# EAGLE design controller (EAGLE 6.5.0)
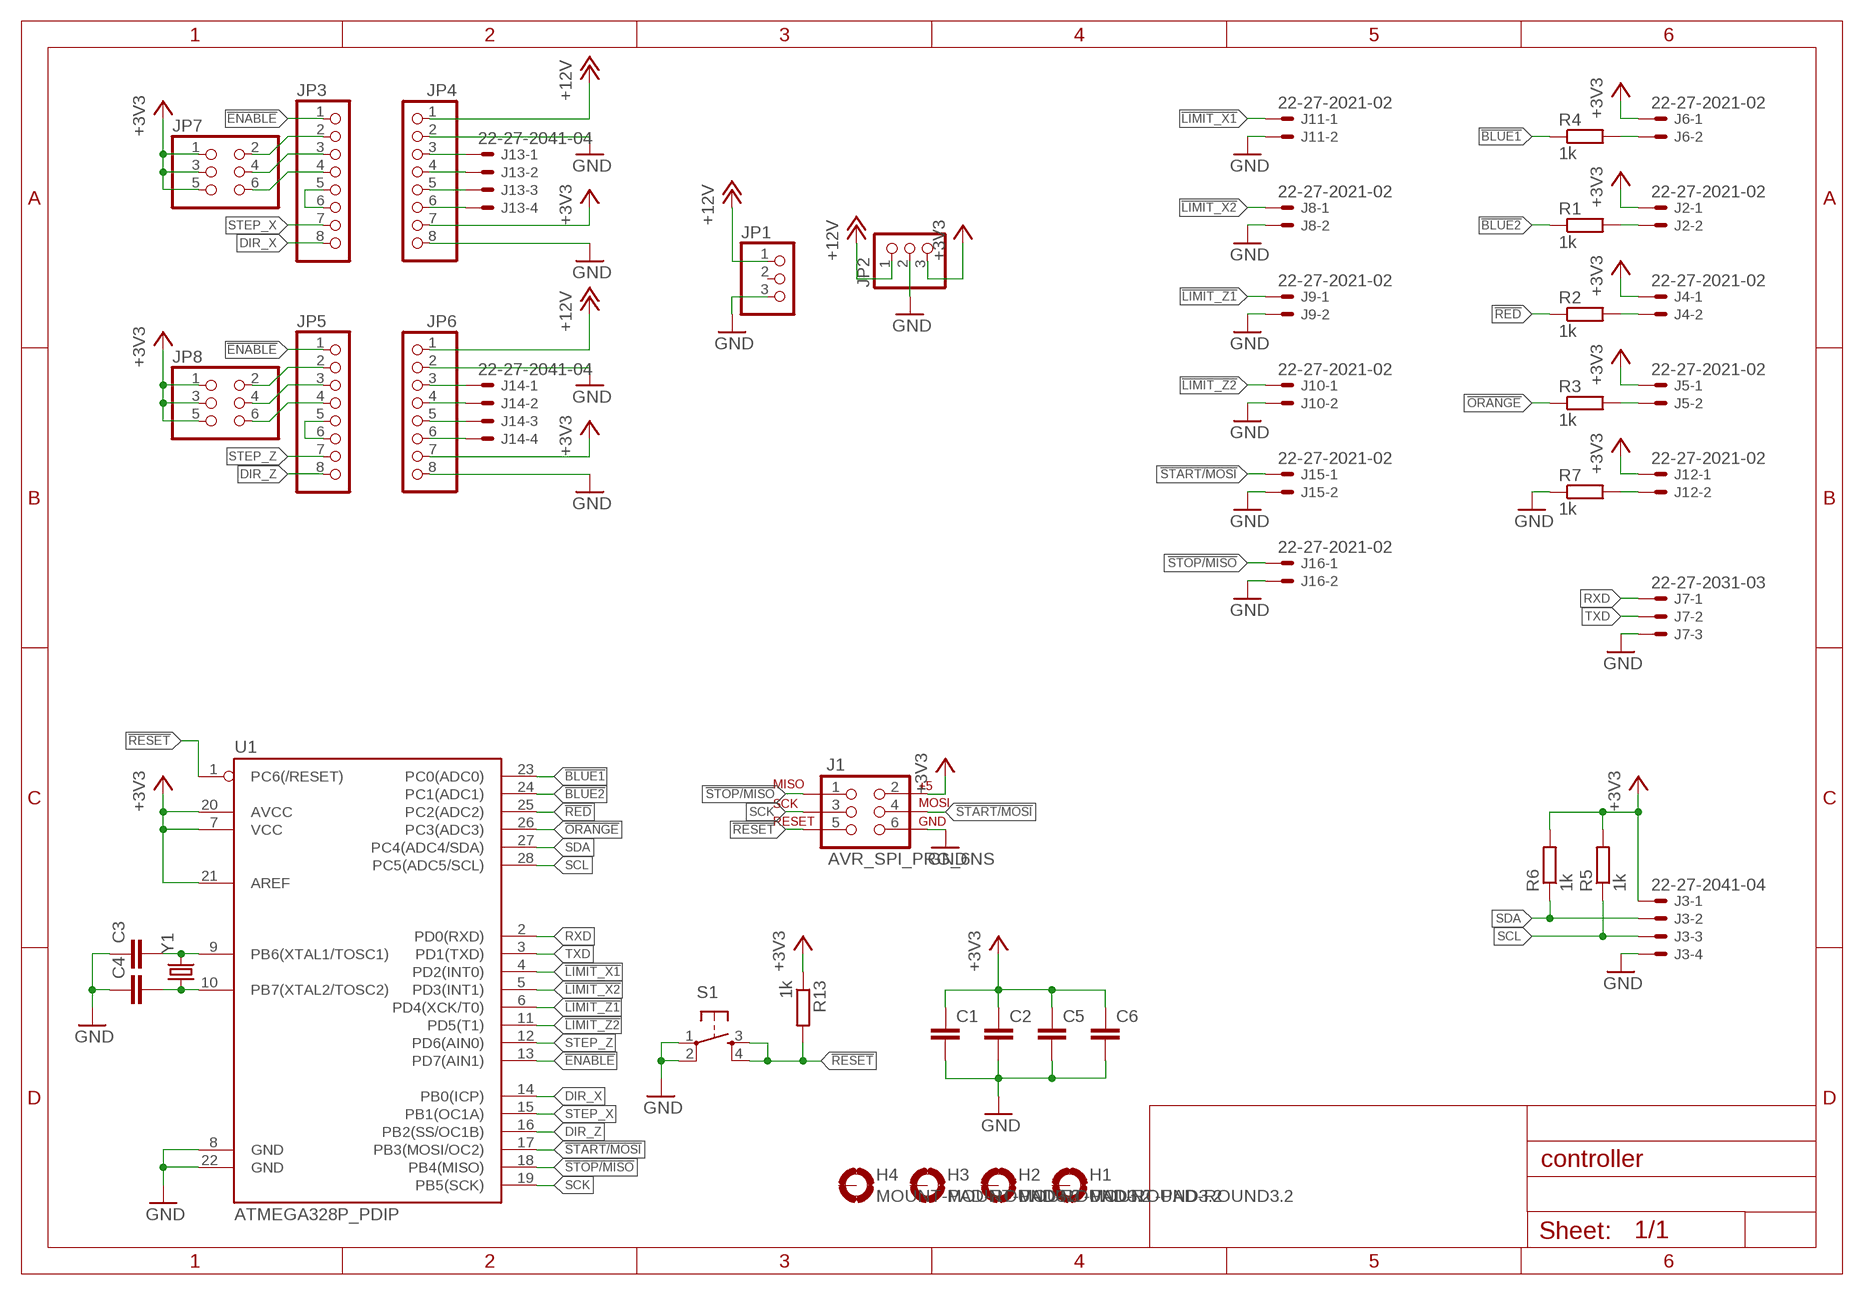
[diagram p0: schematic, sheet 1]

## Parts
C1  C-EUC0603  [C0603]
C2  C-EUC0603  [C0603]
C3  C-EUC0603K  [C0603K]
C4  C-EUC0603K  [C0603K]
C5  C-EUC0603  [C0603]
C6  C-EUC0603  [C0603]
H1  MOUNT-PAD-ROUND3.2  [3,2-PAD]
H2  MOUNT-PAD-ROUND3.2  [3,2-PAD]
H3  MOUNT-PAD-ROUND3.2  [3,2-PAD]
H4  MOUNT-PAD-ROUND3.2  [3,2-PAD]
J1  AVR_SPI_PRG_6NS  [2X3-NS]
J2  22-27-2021-02  [6410-02]
J3  22-27-2041-04  [6410-04]
J4  22-27-2021-02  [6410-02]
J5  22-27-2021-02  [6410-02]
J6  22-27-2021-02  [6410-02]
J7  22-27-2031-03  [6410-03]
J8  22-27-2021-02  [6410-02]
J9  22-27-2021-02  [6410-02]
J10  22-27-2021-02  [6410-02]
J11  22-27-2021-02  [6410-02]
J12  22-27-2021-02  [6410-02]
J13  22-27-2041-04  [6410-04]
J14  22-27-2041-04  [6410-04]
J15  22-27-2021-02  [6410-02]
J16  22-27-2021-02  [6410-02]
JP1  PINHD-1X3  [1X03]
JP2  PINHD-1X3  [1X03]
JP3  PINHD-1X8  [1X08]
JP4  PINHD-1X8  [1X08]
JP5  PINHD-1X8  [1X08]
JP6  PINHD-1X8  [1X08]
JP7  PINHD-2X3  [2X03]
JP8  PINHD-2X3  [2X03]
R1  1k  R-EU_R0603  [R0603]
R2  1k  R-EU_R0603  [R0603]
R3  1k  R-EU_R0603  [R0603]
R4  1k  R-EU_R0603  [R0603]
R5  1k  R-EU_R0603  [R0603]
R6  1k  R-EU_R0603  [R0603]
R7  1k  R-EU_R0603  [R0603]
R13  1k  R-EU_R0603  [R0603]
S1  TAC_SWITCHPTH  [TACTILE-PTH]
U1  ATMEGA328P_PDIP  [DIL28-3]
Y1  CRYSTALHC49UV  [HC49U-V]

## Nets
!BLUE1: R4.1 U1.23(PC0(ADC0))
!BLUE2: R1.1 U1.24(PC1(ADC1))
!ENABLE: JP3.1 JP5.1 U1.13(PD7(AIN1))
!LIMIT_X1: J11.1 U1.4(PD2(INT0))
!LIMIT_X2: J8.1 U1.5(PD3(INT1))
!LIMIT_Z1: J9.1 U1.6(PD4(XCK/T0))
!LIMIT_Z2: J10.1 U1.11(PD5(T1))
!ORANGE: R3.1 U1.26(PC3(ADC3))
!RED: R2.1 U1.25(PC2(ADC2))
!RESET: J1.5 R13.2 S1.3 S1.4 U1.1(PC6(/RESET))
!START/MOSI: J1.4 J15.1 U1.17(PB3(MOSI/OC2))
!STOP/MISO: J1.1 J16.1 U1.18(PB4(MISO))
+3V3: C1.1 C2.1 C5.1 C6.1 J1.2 J2.1 J3.1 J4.1 J5.1 J6.1 J12.1 JP2.3 JP4.7 JP6.7 JP7.1 JP7.3 JP7.5 JP8.1 JP8.3 JP8.5 R5.2 R6.2 R13.1 U1.7(VCC) U1.20(AVCC) U1.21(AREF)
+12V: JP1.1 JP2.1 JP4.1 JP6.1
DIR_X: JP3.8 U1.14(PB0(ICP))
DIR_Z: JP5.8 U1.16(PB2(SS/OC1B))
GND: C1.2 C2.2 C3.1 C4.1 C5.2 C6.2 J1.6 J3.4 J7.3 J8.2 J9.2 J10.2 J11.2 J15.2 J16.2 JP1.3 JP2.2 JP4.2 JP4.8 JP6.2 JP6.8 R7.1 S1.1 S1.2 U1.8(GND) U1.22(GND)
N$1: C3.2 U1.9(PB6(XTAL1/TOSC1)) Y1.2
N$2: C4.2 U1.10(PB7(XTAL2/TOSC2)) Y1.1
N$3: J4.2 R2.2
N$4: J2.2 R1.2
N$5: J5.2 R3.2
N$6: J6.2 R4.2
N$10: JP3.5 JP3.6
N$11: JP3.4 JP7.6
N$12: JP3.3 JP7.4
N$13: JP3.2 JP7.2
N$16: J12.2 R7.2
N$18: JP5.5 JP5.6
N$19: JP5.4 JP8.6
N$20: JP5.3 JP8.4
N$21: JP5.2 JP8.2
N$22: J13.1 JP4.3
N$23: J13.2 JP4.4
N$24: J13.3 JP4.5
N$25: J13.4 JP4.6
N$26: J14.1 JP6.3
N$27: J14.2 JP6.4
N$28: J14.3 JP6.5
N$29: J14.4 JP6.6
RXD: J7.1 U1.2(PD0(RXD))
SCK: J1.3 U1.19(PB5(SCK))
SCL: J3.3 R5.1 U1.28(PC5(ADC5/SCL))
SDA: J3.2 R6.1 U1.27(PC4(ADC4/SDA))
STEP_X: JP3.7 U1.15(PB1(OC1A))
STEP_Z: JP5.7 U1.12(PD6(AIN0))
TXD: J7.2 U1.3(PD1(TXD))
Unconnected: H1.B3,2(MOUNT) H2.B3,2(MOUNT) H3.B3,2(MOUNT) H4.B3,2(MOUNT) JP1.2

## Library data of the parts
C1-C6 = rcl:C-EU: CAPACITOR, European symbol
H1-H4 = holes:MOUNT-PAD-ROUND: MOUNTING PAD, round
J1 = SparkFun-Connectors:AVR_SPI_PRG_6: AVR ISP 6 Pin This is the reduced ISP connector for AVR programming. Common on Arduino. This footprint will take up less PCB space and can be used with a 10-pin to 6-pin adapter such as SKU: BOB-08508
J2 J4-J6 J8-J12 J15 J16 = con-molex:22-?-02: CONNECTOR wire to board 2.54 mm (.1 inch) pitch header; OC_FARNELL: unknown; OC_NEWARK: unknown
J3 J13 J14 = con-molex:22-?-04: CONNECTOR wire to board 2.54 mm (.1 inch) pitch header; OC_FARNELL: unknown; OC_NEWARK: unknown
J7 = con-molex:22-?-03: CONNECTOR wire to board 2.54 mm (.1 inch) pitch header; OC_FARNELL: unknown; OC_NEWARK: unknown
JP1 JP2 = pinhead:PINHD-1X3: PIN HEADER
JP3-JP6 = pinhead:PINHD-1X8: PIN HEADER
JP7 JP8 = pinhead:PINHD-2X3: PIN HEADER
R1-R7 R13 = rcl:R-EU_: RESISTOR, European symbol
S1 = SparkFun-Electromechanical:TAC_SWITCH: Momentary Switch Button commonly used for reset or general input. Spark Fun Electronics SKU : COM-00097 SMT- SWCH-08247
U1 = SparkFun-DigitalIC:ATMEGA328P_PDIP: uC used in the Arduino 32kb flash, 1k EEPROM, 2k SRAM This is the through-hole version of this chip.
Y1 = SparkFun-FreqCtrl:CRYSTAL: Various standard crystals. Proven footprints. Spark Fun Electronics SKU : COM-00534

## Board
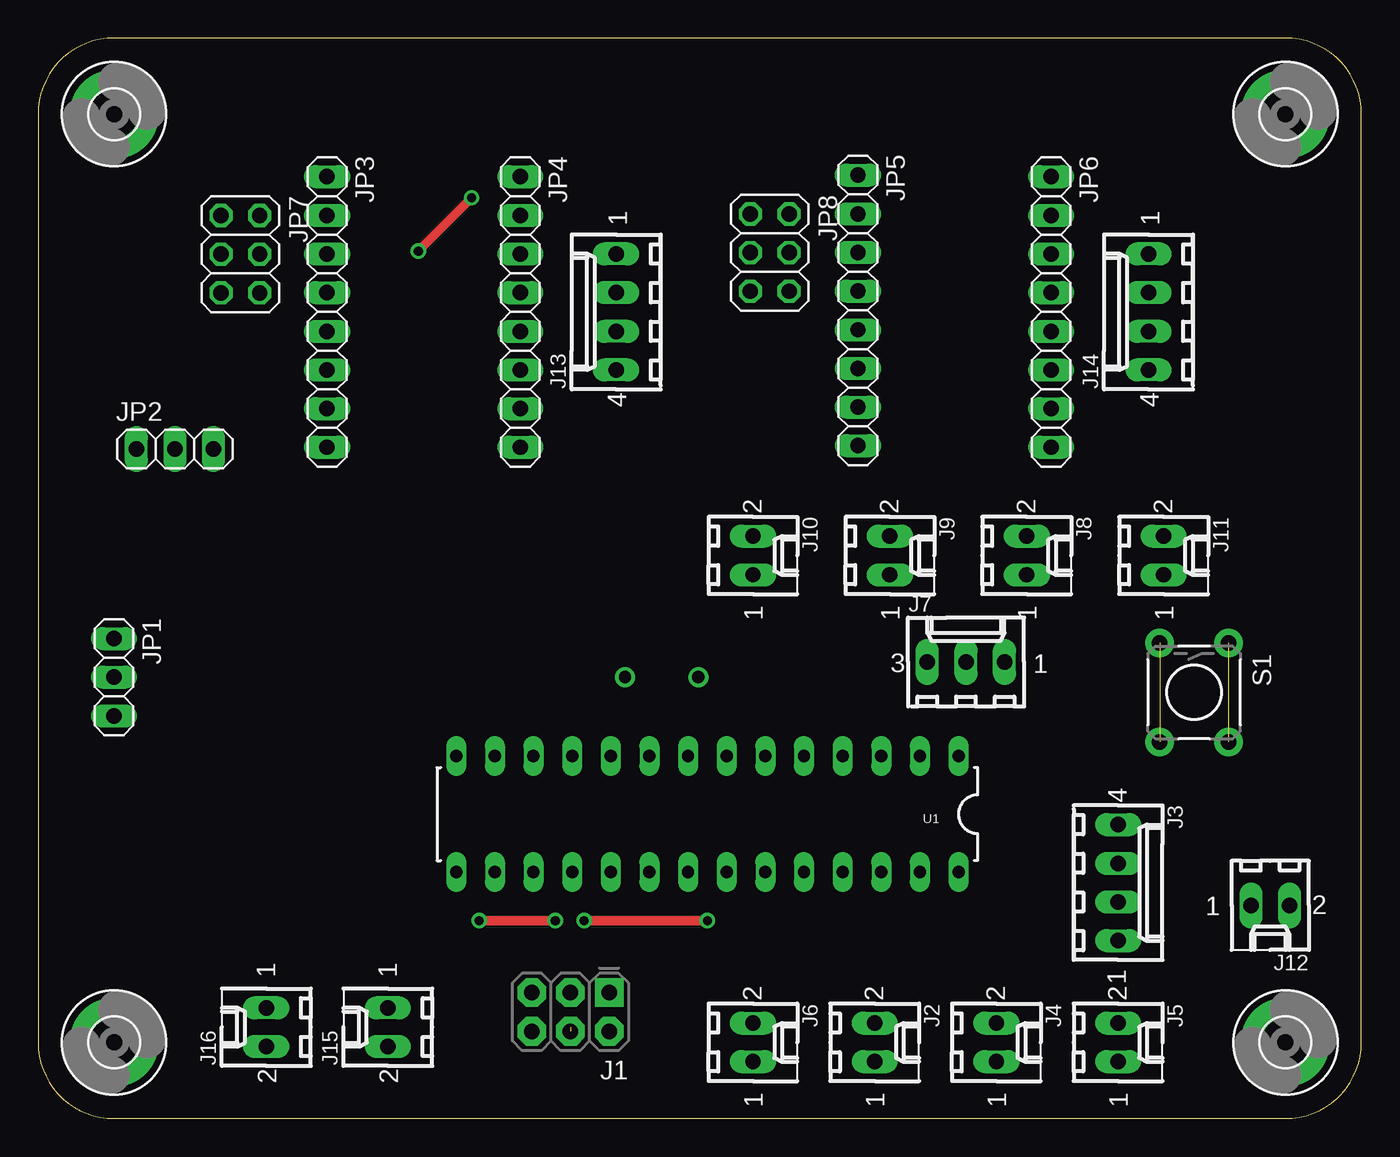
[diagram p1: board, top side]
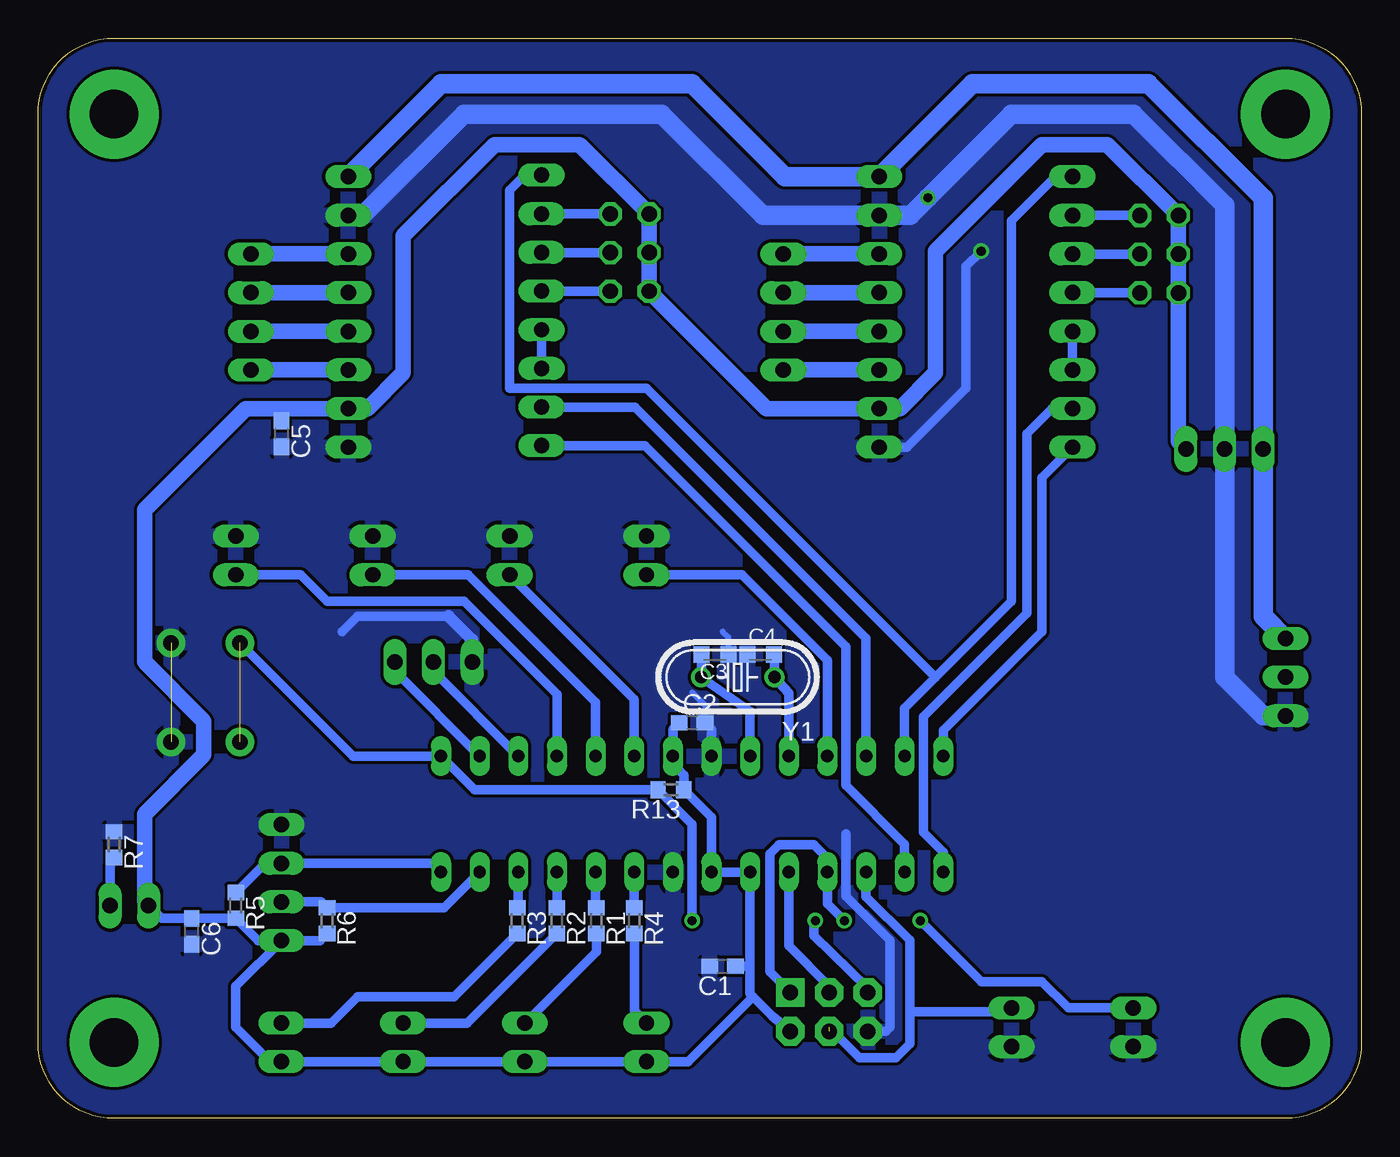
[diagram p2: board, bottom side, seen from below]

Size 87 x 71 mm. Coordinates in mm from the lower left corner, seen from the top.
Outline: 5,0 82,0 arc90 87,5 87,66 arc90 82,71 5,71 arc90 0,66 0,5 arc90 5,0
Copper layers (1*16): Top 0.035mm / dielectric 1.5mm / Bottom 0.035mm
Design rules "default *": minimum track width 10mil, minimum drill 24mil, track to track 8mil, track to pad 8mil, pad to pad 8mil, via to via 8mil, smd to smd 8mil, copper to edge 10mil, drill to drill 8mil, minimum pad ring 10mil, minimum via ring 8mil, stop-mask expansion 4mil, vias tented up to drill 0mil, thermal gap 10mil

### Footprints (pad centres in the part's own frame; a part is rotated, then mirrored left to right if it is on the bottom)
C0603 = smd 1.1 x 1: 1 -0.85,0; 2 0.85,0
C0603K = smd 1.05 x 1.08: 1 -0.875,0; 2 0.875,0
3,2-PAD = drill 3.2 pad 5.842: B3,2 0,0
2X3-NS = drill 1.016 pad 1.88 square: 1 -2.54,-1.27 | drill 1.016 pad 1.88 octagon: 2 -2.54,1.27; 3 0,-1.27; 4 0,1.27; 5 2.54,-1.27; 6 2.54,1.27
6410-02 = drill 1.016 long: 1 1.27,0; 2 -1.27,0
6410-04 = drill 1.016 long: 1 3.81,0; 2 1.27,0; 3 -1.27,0; 4 -3.81,0
6410-03 = drill 1.016 long: 1 2.54,0; 2 0,0; 3 -2.54,0
1X03 = drill 1.016 long: 1 -2.54,0; 2 0,0; 3 2.54,0
1X08 = drill 1.016 long: 1 -8.89,0; 2 -6.35,0; 3 -3.81,0; 4 -1.27,0; 5 1.27,0; 6 3.81,0; 7 6.35,0; 8 8.89,0
2X03 = drill 1.016 octagon: 1 -2.54,-1.27; 2 -2.54,1.27; 3 0,-1.27; 4 0,1.27; 5 2.54,-1.27; 6 2.54,1.27
R0603 = smd 1 x 1.1: 1 -0.85,0; 2 0.85,0
TACTILE-PTH = drill 1.016 pad 1.88: 1 -3.251,2.261; 2 3.251,2.261; 3 -3.251,-2.261; 4 3.251,-2.261
DIL28-3 = drill 0.813 long: 1 -16.51,-3.81; 2 -13.97,-3.81; 3 -11.43,-3.81; 4 -8.89,-3.81; 5 -6.35,-3.81; 6 -3.81,-3.81; 7 -1.27,-3.81; 8 1.27,-3.81; 9 3.81,-3.81; 10 6.35,-3.81; 11 8.89,-3.81; 12 11.43,-3.81; 13 13.97,-3.81; 14 16.51,-3.81; 15 16.51,3.81; 16 13.97,3.81; 17 11.43,3.81; 18 8.89,3.81; 19 6.35,3.81; 20 3.81,3.81; 21 1.27,3.81; 22 -1.27,3.81; 23 -3.81,3.81; 24 -6.35,3.81; 25 -8.89,3.81; 26 -11.43,3.81; 27 -13.97,3.81; 28 -16.51,3.81
HC49U-V = drill 0.813: 1 -2.413,0; 2 2.413,0

### Placement (x,y rotation side)
C1  42,10 180 bottom
C2  44,26 0 bottom
C3  42.5,30.5 180 bottom
C4  39.5,30.5 0 bottom
C5  71,45 270 bottom
C6  76.9,12.3 270 bottom
H1  5,5 0 top
H2  82,5 0 top
H3  82,66 0 top
H4  5,66 0 top
J1  35,7 180 top
J2  55,5 270 top
J3  71,15.5 270 top
J4  63,5 270 top
J5  71,5 270 top
J6  47,5 270 top
J7  61,30 0 top
J8  65,37 270 top
J9  56,37 270 top
J10  47,37 270 top
J11  74,37 270 top
J12  81,14 180 top
J13  38,53 90 top
J14  73,53 90 top
J15  23,6 90 top
J16  15,6 90 top
JP1  5,29 270 top
JP2  9,44 0 top
JP3  19,53 270 top
JP4  31.7,53 270 top
JP5  53.9,53.1 270 top
JP6  66.6,53 270 top
JP7  13.3,56.8 270 top
JP8  48.1,56.9 270 top
R1  50.3,13 270 bottom
R2  52.9,13 270 bottom
R3  55.5,13 270 bottom
R4  47.8,13 270 bottom
R5  74,14 270 bottom
R6  68,13 270 bottom
R7  82,18 270 bottom
R13  45.4,21.6 180 bottom
S1  76,28 270 top
U1  44,20 180 top
Y1  41,29 180 bottom

### Tracks (layer width: path | path; a pad name or v marks a point on that pad's centre or on a via)
!BLUE1
  Bottom 0.61: R4.1 U1.23
!BLUE2
  Bottom 0.61: R1.1 50.35,13.9 U1.24
!ENABLE
  Bottom 0.61: U1.13 30.03,26.97 28,29 | 28,29 23,34 23,59 20.11,61.89 JP3.1 | JP5.1 55.01,61.99 56,61 56,48 47,48 28,29
!LIMIT_X1
  Bottom 0.61: U1.4 52.89,27.89 59,34 68,34 69.73,35.73 J11.1
!LIMIT_X2
  Bottom 0.61: U1.5 50.35,27.35 58.73,35.73 J8.1
!LIMIT_Z1
  Bottom 0.61: U1.6 47.81,27.54 J9.1
!LIMIT_Z2
  Bottom 0.61: U1.11 35.11,30.11 40.73,35.73 J10.1
!ORANGE
  Bottom 0.61: R3.1 55.43,13.92 U1.26
!RED
  Bottom 0.61: R2.1 U1.25
!RESET  (via drill 0.6)  (1 unrouted)
  Top 0.61: v35.9,13 v44,13
  Bottom 0.61: S1.3 66.3,23.81 U1.1 58.3,21.6 R13.2 44,19.35 v44,13 | J1.5 32.46,8.56 36,12 36,12.9 v35.9,13
!START/MOSI  (1 unrouted)
  Bottom 0.61: 35,6 33,4 30.6,4 29.7,4.9 29.7,7 | 29.7,7 29.7,11.7 32.57,14.57 U1.17 | J15.1 23.27,7 29.7,7
!STOP/MISO  (via drill 0.6)
  Top 0.61: v34,13 v29,13
  Bottom 0.61: J1.1 38.9,9.63 38.9,17.4 38.3,18 36,18 35.11,17.11 U1.18 35.11,14.11 v34,13 | v29,13 25,9 21,9 19.27,7.27 J16.1
+3V3
  Bottom 0.61: J1.2 38.73,6.73 40,8 | 40,8 40.19,8.19 40.19,10 | 40.19,10 U1.20 U1.21 42.73,19.78 R13.1 44.55,22.55 45.27,23.27 U1.7 45.27,25.58 C2.1 | R6.2 68.46,11.69 J3.1 | 40,8 44.27,3.73 J6.1 J2.1 J4.1 J5.1 71.73,3.73 74,6 74,8.69 J3.1 | J3.1 72.54,11.69 R5.2 C6.1 78.88,13.15 J12.1 | C5.1 71,46.65 | C1.1 40.19,10
  Bottom 1.016: JP2.3 12.03,44.49 JP7.5 JP7.3 JP7.1 16.69,64 21,64 28,57 28,49 30.35,46.65 JP4.7 39.12,46.65 JP8.5 JP8.3 JP8.1 51.39,64 57,64 63,58 63,49 65.35,46.65 JP6.7 71,46.65 73.35,46.65 80,40 80,30 76.1,26.1 76.1,23.9 80,20 80,14.27 J12.1
+12V
  Bottom 1.27: JP6.1 60.49,68 44,68 37.89,61.89 JP4.1 25.59,68 14,68 6.46,60.46 JP2.1 6.46,33 JP1.1
DIR_X
  Bottom 0.61: U1.14 27.49,25.51 21,32 21,42.11 JP3.8
DIR_Z
  Bottom 0.61: JP5.8 47.11,44.21 33.9,31 33.9,21.9 30.03,18.03 U1.16
GND  (via drill 0.6)  (1 unrouted)
  Top 0.61: v25,57 v28.5,60.5
  Bottom 0.406: C2.2 43.15,26.85 43,27 44,28 | C3.1 41.62,31.62 42,32
  Bottom 0.61: U1.8 42.73,25.58 C2.2 | 60,33 66,33 67,32 | J1.6 31.27,5.73 31,6 31,11.7 33.9,14.6 33.9,18.7 | JP4.8 29.89,44.11 26,48 26,56 v25,57
  Bottom 0.813: J7.3 58.46,31.46 60,33
  Bottom 1.27: JP6.2 65.65,59.35 59,66 46,66 39.35,59.35 JP4.2 29.65,59.35 v28.5,60.5 23,66 15,66 9,60 JP2.2 9,29 6.46,26.46 JP1.3
  pour Bottom: 0,0 87,0 87,71 0,71
N$1
  Bottom 0.61: U1.9 40.19,26.78 Y1.2 43.38,29.04 C3.2
N$2
  Bottom 0.61: U1.10 37.65,27.94 Y1.1 38.59,30.46 C4.2
N$3
  Bottom 0.61: R2.2 58.78,6.27 J4.2
N$4
  Bottom 0.61: J2.2 50.3,10.97 R1.2
N$5
  Bottom 0.61: R3.2 59.65,8 66,8 67.73,6.27 J5.2
N$6
  Bottom 0.61: J6.2 47.8,7.07 R4.2
N$10
  Bottom 0.61: JP3.5 JP3.6
N$11
  Bottom 0.61: JP7.6 JP3.4
N$12
  Bottom 0.61: JP7.4 JP3.3
N$13
  Bottom 0.61: JP7.2 JP3.2
N$16
  Bottom 0.61: J12.2 82.27,16.58 R7.2
N$18
  Bottom 0.61: JP5.5 JP5.6
N$19
  Bottom 0.61: JP8.6 JP5.4
N$20
  Bottom 0.61: JP8.4 JP5.3
N$21
  Bottom 0.61: JP8.2 JP5.2
N$22
  Bottom 1.016: JP4.3 J13.1
N$23
  Bottom 1.016: JP4.4 J13.2
N$24
  Bottom 1.016: JP4.5 J13.3
N$25
  Bottom 1.016: JP4.6 J13.4
N$26
  Bottom 1.016: JP6.3 J14.1
N$27
  Bottom 1.016: JP6.4 J14.2
N$28
  Bottom 1.016: JP6.5 J14.3
N$29
  Bottom 1.016: JP6.6 J14.4
RXD
  Bottom 0.61: U1.2 63.54,29.38 J7.1
SCK
  Bottom 0.61: J1.3 35,8.7 37.65,11.35 U1.19
SCL
  Bottom 0.61: U1.28 61.09,16.77 J3.3 72.08,16.77 R5.1
SDA
  Bottom 0.61: J3.2 68.38,14.23 R6.1 60.31,13.85 U1.27
STEP_X
  Bottom 0.61: U1.15 27.49,17.49 28.8,18.8 28.8,26.4 22,33.2 22,45 20.35,46.65 JP3.7
STEP_Z
  Bottom 0.61: JP5.7 47.75,46.75 32.57,31.57 U1.12
TXD
  Bottom 0.61: U1.3 61,29.38 J7.2